# EasyEDA schematic Smart Project Eagle.json
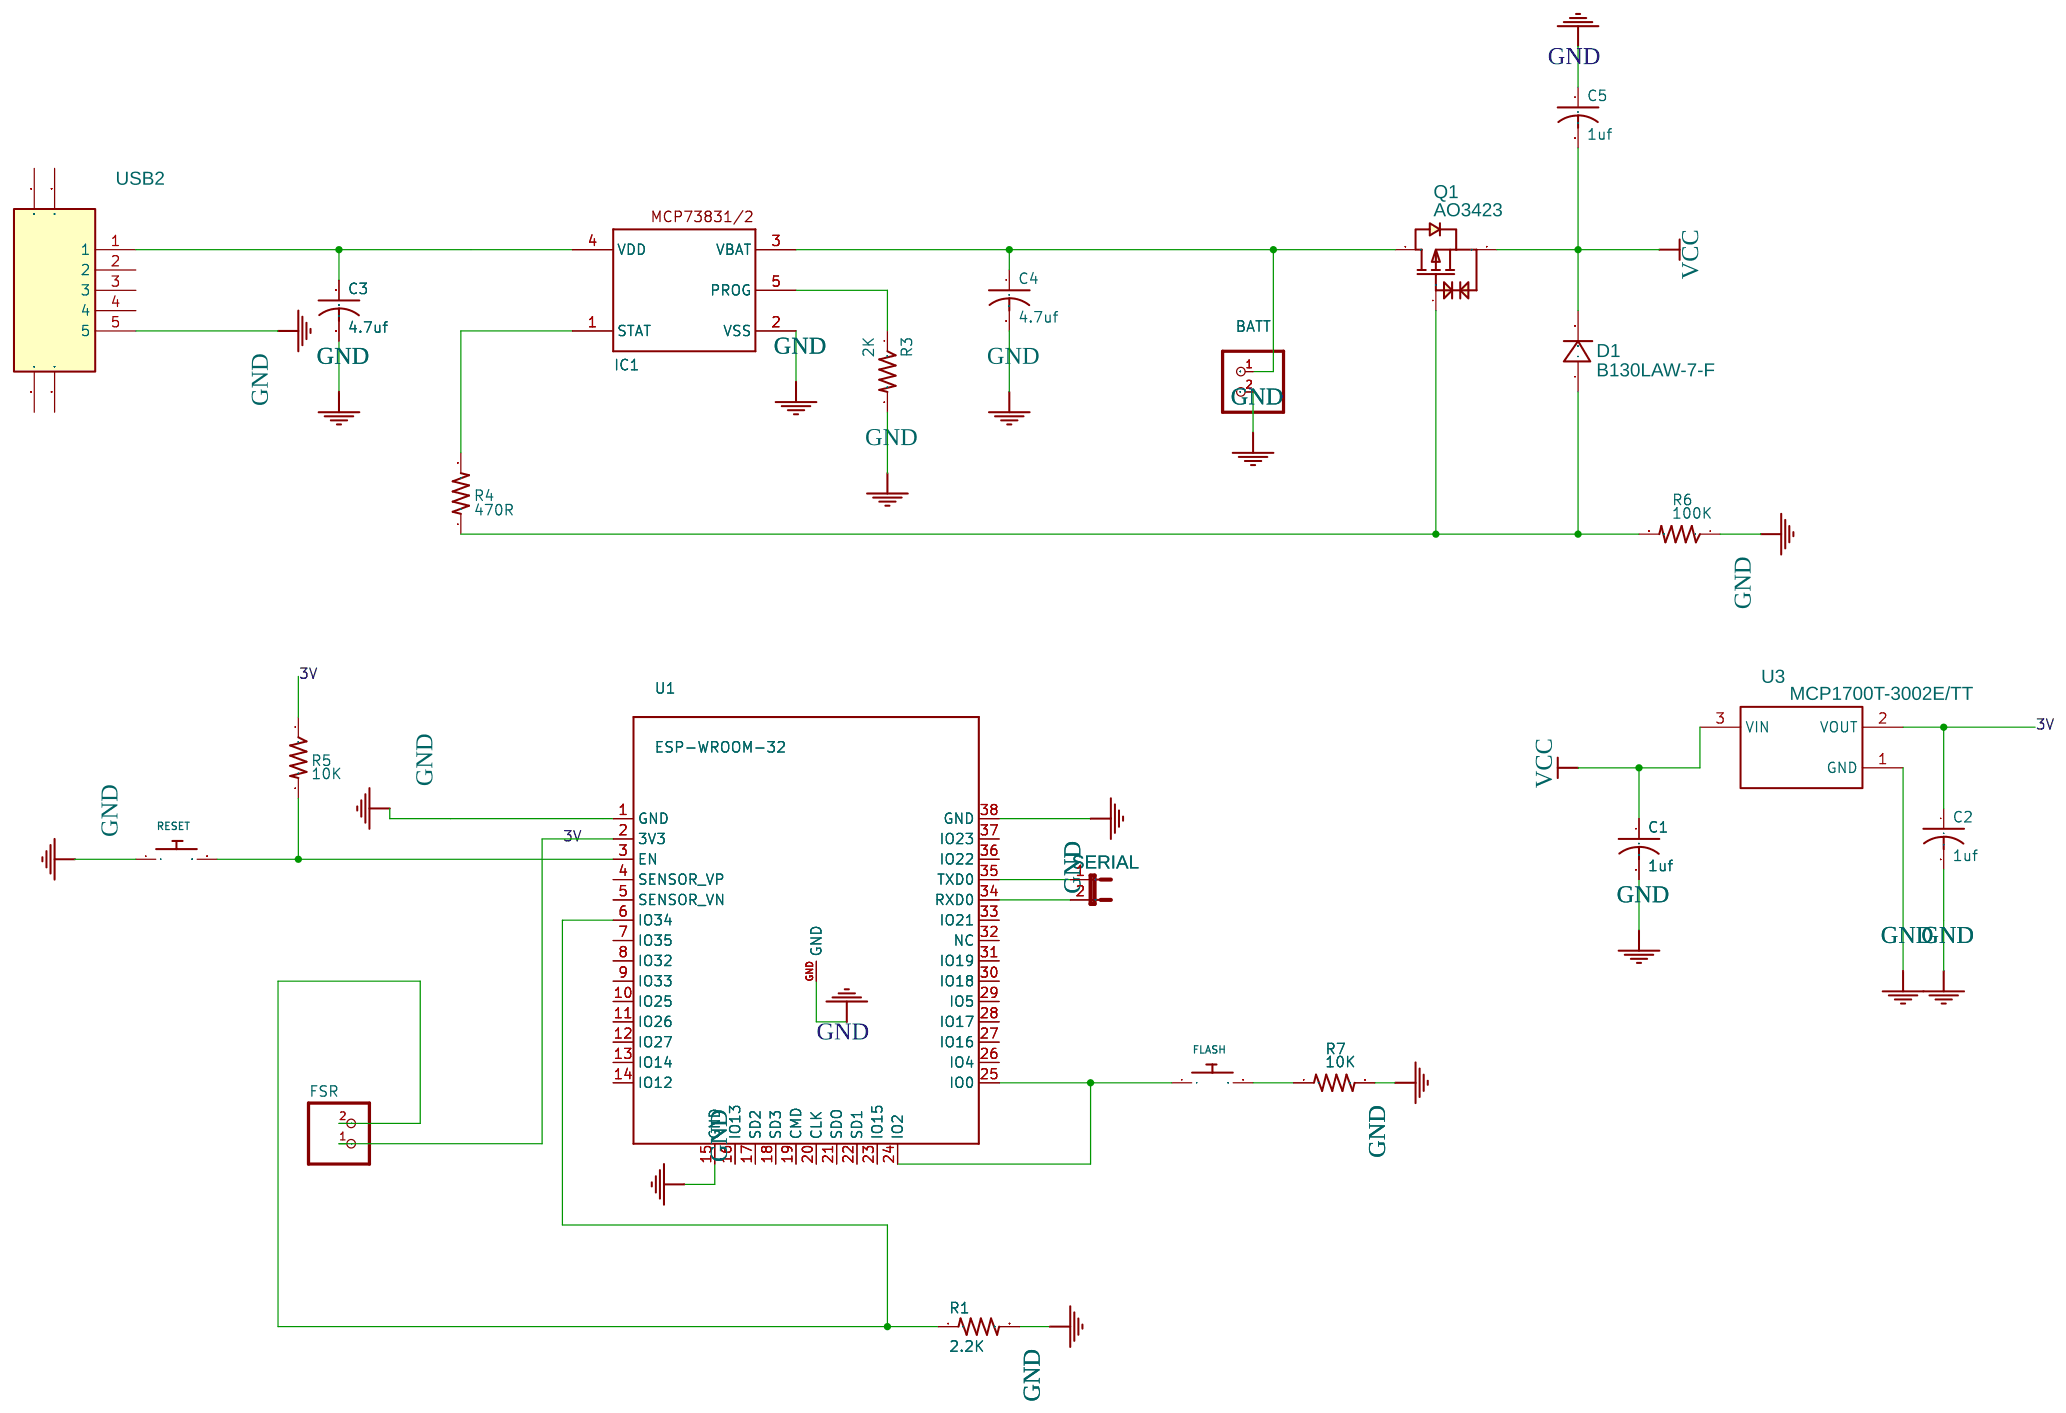
[diagram p0: schematic sheet]

## Parts
BATT  JST_2PIN-SMT  [JST-PH-2-SMT]
C1  1uf  [C0805K]
C2  1uf  [C0805K]
C3  4.7uf  [C0805K]
C4  4.7uf  [C0805K]
C5  1uf  [C0805K]
D1  B130LAW-7-F  [SOD-123]
FLASH  SWITCH_PUSHBUTTONC&K_KSS  [TACTILE_SWITCH-SMD-RIGHT-ANGLE]
FSR  JST_2PIN-SMT  [JST-PH-2-SMT]
IC1  MCP73831/OT  [SOT23-5L]
JP1  SERIAL  [JUMPER2]
Q1  AO3423  [SOT-23-3L]
R1  2.2K  [SM0805]
R3  2K  [SM0805]
R4  470R  [SM0805]
R5  10K  [SM0805]
R6  100K  [SM0805]
R7  10K  [SM0805]
RESET  SWITCH_PUSHBUTTONC&K_KSS  [TACTILE_SWITCH-SMD-RIGHT-ANGLE]
U1  ESP-WROOM-32  [ESP-WROOM-32]
U3  MCP1700T-3002E/TT  [SOT-23(SOT-23-3)]
USB2  micro 5PAll posts are not guided Flat welding_C40942  [MICRO-USB-12]

## Library data of the parts
D1 = -: Supplier: LCSC; LCSC: C129191; Manufacturer: DIODES; Contributor: LCSC
JP1 = -: Jumper 2 Pin; Contributor: PatternAgents; Manufacturer Part: ?
Q1 = -: Supplier: LCSC; Manufacturer: AOS; LCSC: C73257
U1 = -: Supplier: Element14
U3 = -: Supplier: LCSC; Manufacturer: MICROCHIP; LCSC: C62244
USB2 = -: Supplier: LCSC; Manufacturer: ValuePro; Manufacturer Part: micro 5PAll posts are not guided Flat welding; LCSC: C40942; image: //image.lceda.cn/szlcsc/C40942.jpg

## Nets
3V: C2.1 FSR.1(2) R5.1 U1.2(3V3) U3.2(VOUT)
GND: BATT.2(1) C1.2 C2.2 C3.2 C4.2 C5.1 IC1.2(VSS) R1.2 R3.2 R6.1 R7.2 RESET.1 U1.1(GND) U1.15(GND) U1.38(GND) U1.GND U3.1(GND) USB2.5
VCC: C1.1 C5.2 D1.2 Q1.2(S) U3.3(VIN)
Net-(BATT-1): BATT.1(2) C4.1 IC1.3(VBAT) Q1.3(D)
Net-(C3-1): C3.1 IC1.4(VDD) USB2.1
Net-(D1-1): D1.1 Q1.1(G) R4.1 R6.2
Net-(FLASH-1): FLASH.1 U1.24(IO2) U1.25(IO0)
Net-(FLASH-2): FLASH.2 R7.1
Net-(FSR-2): FSR.2(1) R1.1 U1.6(IO34)
Net-(IC1-1): IC1.1(STAT) R4.2
Net-(IC1-5): IC1.5(PROG) R3.1
Net-(JP1-1): JP1.1 U1.35(TXD0)
Net-(JP1-2): JP1.2 U1.34(RXD0)
Net-(R5-2): R5.2 RESET.2 U1.3(EN)

Not connected (* = marked no-connect by the designer): U1 4(SENSOR_VP) 5(SENSOR_VN) 7(IO35) 8(IO32) 9(IO33) 10(IO25) 11(IO26) 12(IO27) 13(IO14) 14(IO12) 16(IO13) 17(SD2) 18(SD3) 19(CMD) 20(CLK) 21(SDO) 22(SD1) 23(IO15) 26(IO4) 27(IO16) 28(IO17) 29(IO5) 30(IO18) 31(IO19) 32(NC) 33(IO21) 36(IO22) 37(IO23); USB2 0 2 3 4
